# Altium schematic sheet Rs232IC.SchDoc
size A4; CheckedBy: Everyone; DocumentNumber: 3; SheetNumber: 3; SheetTotal: 4
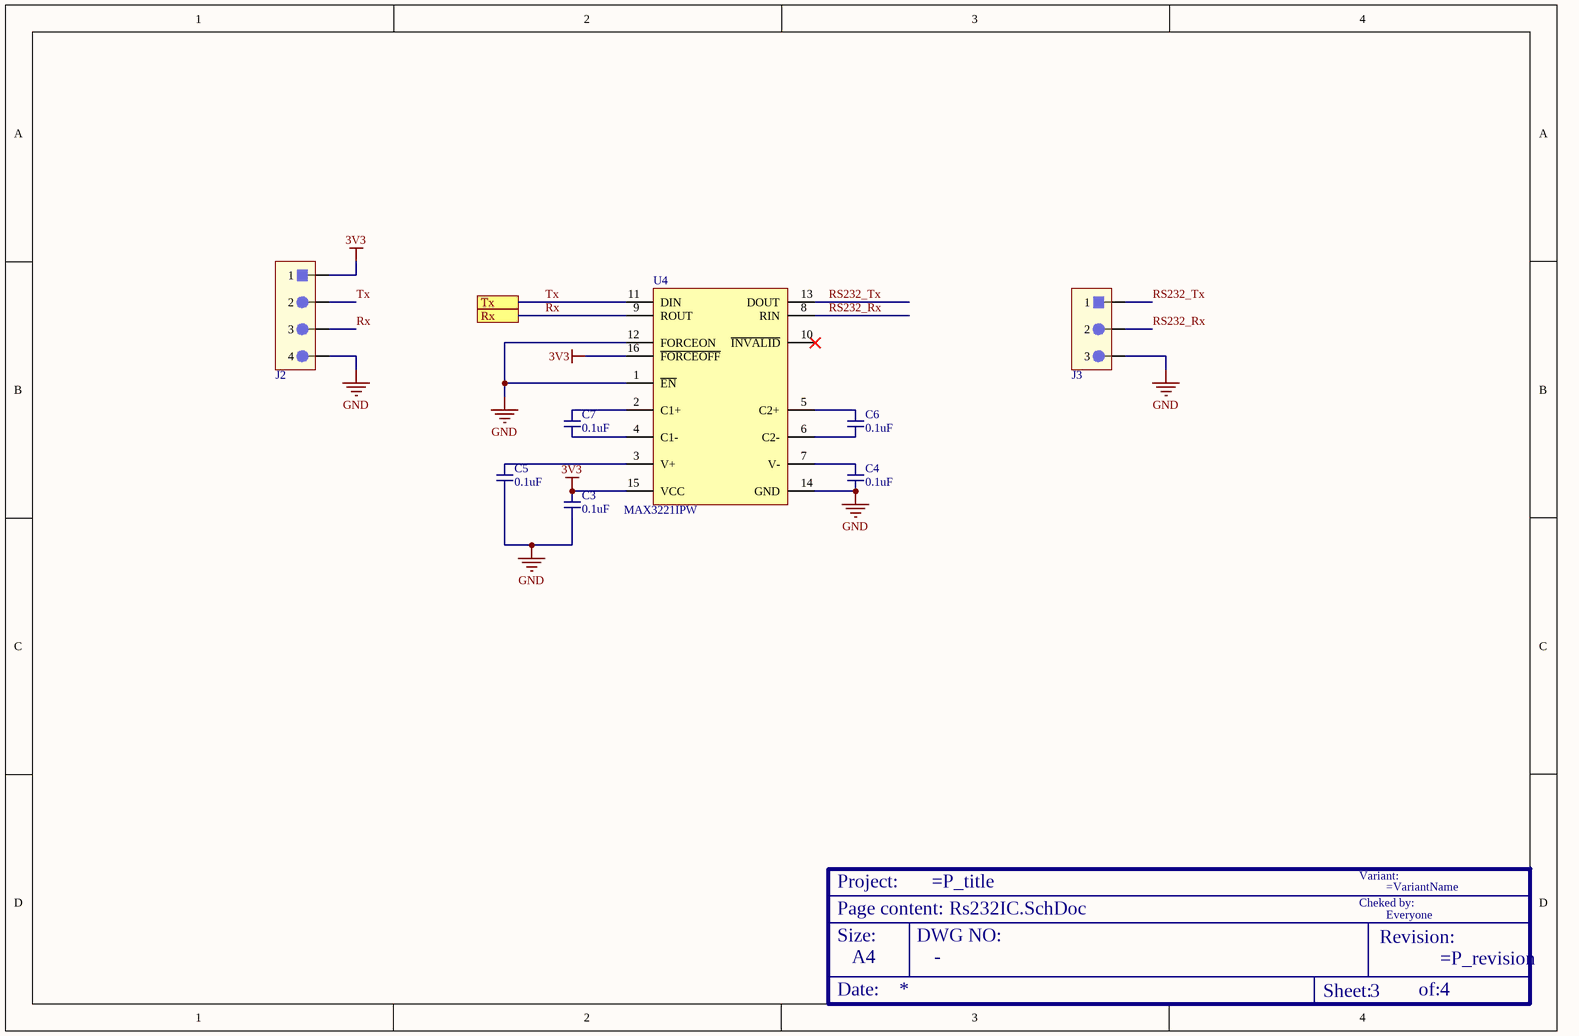
[diagram p0: Rs232IC.SchDoc]

## Parts
?  Size: A4  (hidden comment: TitleBox)  (graphical)
C3  value 0.1uF  [0603C]  (hidden comment: Ceramic Capacitor)
C4  value 0.1uF  [0603C]  (hidden comment: Ceramic Capacitor)
C5  value 0.1uF  [0603C]  (hidden comment: Ceramic Capacitor)
C6  value 0.1uF  [0603C]  (hidden comment: Ceramic Capacitor)
C7  value 0.1uF  [0603C]  (hidden comment: Ceramic Capacitor)
J2  Conector  [61300411121]  (value not drawn)
J3  Conector  [61300311121]  (value not drawn)
U4  value MAX3221IPW  [TI-PW16_M]  (hidden comment: RS232 Serie CI)

## Ports
Rx, Tx

## Nets
3V3: C3.1 J2.1 U4.15(VCC) U4.16(~{FORCEOFF})
GND: C3.2 C4.2 C5.2 J2.4 J3.3 U4.1(~{EN}) U4.12(FORCEON) U4.14(GND)
RS232_Rx: J3.2 U4.8(RIN)
RS232_Tx: J3.1 U4.13(DOUT)
Rx: J2.3 U4.9(ROUT) ; port Rx
Tx: J2.2 U4.11(DIN) ; port Tx
NetC4_1: C4.1 U4.7(V-)
NetC5_1: C5.1 U4.3(V+)
NetC6_1: C6.1 U4.5(C2+)
NetC6_2: C6.2 U4.6(C2-)
NetC7_1: C7.1 U4.2(C1+)
NetC7_2: C7.2 U4.4(C1-)

Not connected (* = marked no-connect by the designer): U4 10(~{INVALID})*

## Notes on the sheet
- (in symbol TitleBox_1) Variant:; Project:; Cheked by:; Page content:; Size:; DWG NO:; Revision:; Date:; Sheet:; of:

## Library data of the parts
? = TitleBox_1: coordenadas: (610;20) Size A4; DWG No: -
C3-C7 = CC: notas: *
J2 = Conector 4 pins: Value: 4; notas: *
J3 = Conector 3 pins: Value: 3; notas: *
U4 = MAX3221IPW: 3-V to 5.5-V Single-Channel RS-232 Line Driver / Receiver with ±15-kV ESD Protection, -40 to 85 degC, 16-Pin TSSOP (PW), Green (RoHS & no Sb/Br); Drivers Per Package: 1; Single Supply: TRUE; ESD HBM(kV): +/-15; Supply Voltage(s)(V): 3.3 or 5.0; ComponentLink1Description: Manufacturer URL; ComponentLink2Description: Datasheet; ComponentLink3Description: Package Specification; ComponentLink3URL: http://www.ti.com/litv/pdf/mpds361; DatasheetVersion: SLLS348M; ComponentLink1URL: www.ti.com; ComponentLink2URL: http://www.ti.com/general/docs/lit/getliterature.tsp?genericPartNumber=MAX3221&fileType=pdf; ICC(Max)(mA): 1; RS-232: TRUE; PackageVersion: revG, Feb-2011; SubFamily: RS-232; PackageDescription: 16-Pin Plastic Thin Small Outline Package 5 x 4.4 mm Body ,0.65 mm Pitch; Receivers Per Package: 1; PackageReference: PW16; PartNumber: MAX3221IPW; notas: *